# Altium schematic sheet Top.SchDoc
size A4; SheetNumber: 1; SheetTotal: 5
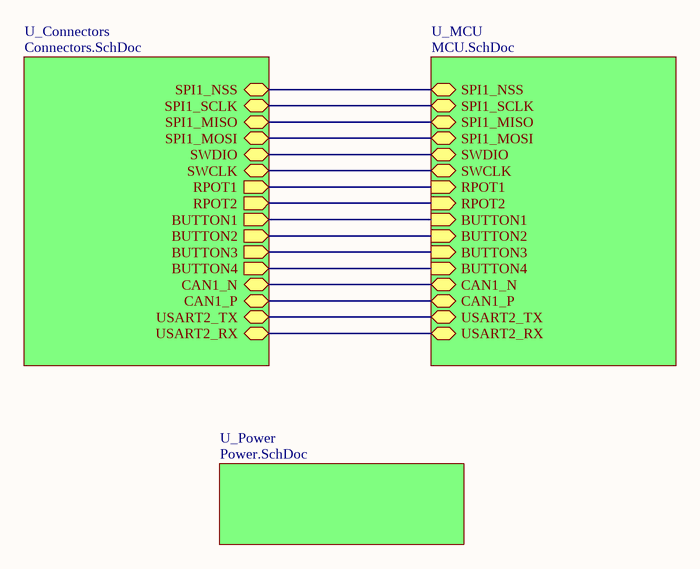
[diagram p0: Top.SchDoc]

## Sub-sheets
U_Connectors = Connectors.SchDoc: BUTTON1 (out), BUTTON3 (out), BUTTON4 (out), BUTTON2 (out), USART2_RX (bidir), USART2_TX (bidir), RPOT1 (out), RPOT2 (out), SPI1_MOSI (bidir), SPI1_MISO (bidir), SPI1_SCLK (bidir), SPI1_NSS (bidir), SWDIO (bidir), SWCLK (bidir), CAN1_P (bidir), CAN1_N (bidir)
U_MCU = MCU.SchDoc: USART2_RX (bidir), SPI1_NSS (bidir), SPI1_SCLK (bidir), SPI1_MISO (bidir), SPI1_MOSI (bidir), SWDIO (bidir), SWCLK (bidir), RPOT1 (in), RPOT2 (in), BUTTON3 (in), BUTTON4 (in), BUTTON2 (in), BUTTON1 (in), CAN1_N (bidir), CAN1_P (bidir), USART2_TX (bidir)
U_Power = Power.SchDoc: no entries

## Nets
(unnamed): sheet U_MCU/USART2_RX, sheet U_Connectors/USART2_RX
(unnamed): sheet U_MCU/SPI1_NSS, sheet U_Connectors/SPI1_NSS
(unnamed): sheet U_MCU/SPI1_SCLK, sheet U_Connectors/SPI1_SCLK
(unnamed): sheet U_MCU/SPI1_MISO, sheet U_Connectors/SPI1_MISO
(unnamed): sheet U_MCU/SPI1_MOSI, sheet U_Connectors/SPI1_MOSI
(unnamed): sheet U_MCU/SWDIO, sheet U_Connectors/SWDIO
(unnamed): sheet U_MCU/SWCLK, sheet U_Connectors/SWCLK
(unnamed): sheet U_MCU/RPOT1, sheet U_Connectors/RPOT1
(unnamed): sheet U_MCU/RPOT2, sheet U_Connectors/RPOT2
(unnamed): sheet U_MCU/BUTTON3, sheet U_Connectors/BUTTON3
(unnamed): sheet U_MCU/BUTTON4, sheet U_Connectors/BUTTON4
(unnamed): sheet U_MCU/BUTTON2, sheet U_Connectors/BUTTON2
(unnamed): sheet U_MCU/BUTTON1, sheet U_Connectors/BUTTON1
(unnamed): sheet U_MCU/CAN1_N, sheet U_Connectors/CAN1_N
(unnamed): sheet U_MCU/CAN1_P, sheet U_Connectors/CAN1_P
(unnamed): sheet U_MCU/USART2_TX, sheet U_Connectors/USART2_TX